# Altium schematic sheet Sunflower.SchDoc
size A; SheetNumber: 1; SheetTotal: 3
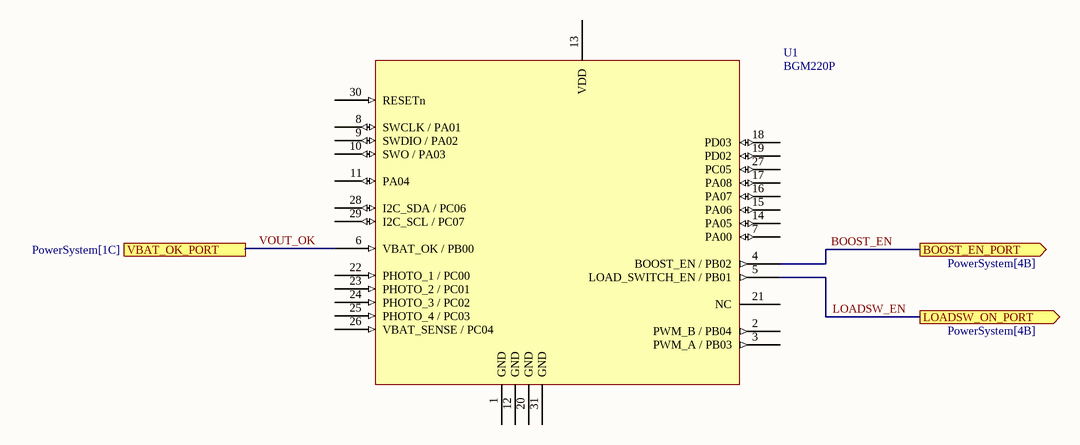
[diagram p0: Sunflower.SchDoc]

## Parts
U1  BGM220P  [BGM220PC22HNA2]

## Ports
BOOST_EN_PORT (out, see PowerSystem[4B]), LOADSW_ON_PORT (out, see PowerSystem[4B]), VBAT_OK_PORT (see PowerSystem[1C])

## Nets
BOOST_EN: U1.4(BOOST_EN_/_PB02) ; port BOOST_EN_PORT
LOADSW_EN: U1.5(LOAD_SWITCH_EN_/_PB01) ; port LOADSW_ON_PORT
VOUT_OK: U1.6(VBAT_OK_/_PB00) ; port VBAT_OK_PORT

Not connected (* = marked no-connect by the designer): U1 1(GND) 2(PWM_B_/_PB04) 3(PWM_A_/_PB03) 7(PA00) 8(SWCLK_/_PA01) 9(SWDIO_/_PA02) 10(SWO_/_PA03) 11(PA04) 12(GND) 13(VDD) 14(PA05) 15(PA06) 16(PA07) 17(PA08) 18(PD03) 19(PD02) 20(GND) 21(NC) 22(PHOTO_1_/_PC00) 23(PHOTO_2_/_PC01) 24(PHOTO_3_/_PC02) 25(PHOTO_4_/_PC03) 26(VBAT_SENSE_/_PC04) 27(PC05) 28(I2C_SDA_/_PC06) 29(I2C_SCL_/_PC07) 30(RESETn) 31(GND)

## Library data of the parts
U1 = BGM220PC22HNA2R: Wireless bluetooth PCB module, Secure Boot w/Root of Trust and Secure Loader, Built-in antenna; Manufacturer: Silicon Lab; Data Rate: 2Mbps; Max Supply Voltage: 3.8V; Min Supply Voltage: 1.8V; Nominal Supply Voltage (DC): 3V; Number of Circuits: 1; Supplier: DigiKey; Supplier Part Number: 336-BGM220PC22HNA2RCT-ND; Manufacturer Part Number: BGM220PC22HNA2R; Category: RF Receivers, Transceivers; Stock: 4488; Pricing: 1=10.46, 10=8.91, 25=8.384, 100=7.6726, 250=7.25176, 500=6.95712, 1000=5.66221 (USD); Composition: Hybrid; Height - Seated (Max): 2.4mm; Length: 15mm; Lifecycle Status: Production; Max Operating Temperature: 105°C; Min Operating Temperature: -40°C; Number of Terminals: 31; Terminal Pitch: 1.2mm; Width: 12.9mm; ComponentLink1URL: https://datasheet.octopart.com:443/BGM220PC22HNA2R-Silicon-Labs-datasheet-180780823.pdf?src-supplier=IHS; ComponentLink1Description: https://datasheet.octopart.com:443/BGM220PC22HNA2R-Silicon-Labs-datasheet-180780823.pdf?src-supplier=IHS; ComponentLink2URL: https://datasheet.octopart.com:443/BGM220PC22HNA2R-Silicon-Labs-datasheet-150822196.pdf?src-supplier=Farnell; ComponentLink2Description: https://datasheet.octopart.com:443/BGM220PC22HNA2R-Silicon-Labs-datasheet-150822196.pdf?src-supplier=Farnell; Digikey Part Number: 336-BGM220PC22HNA2RCT-ND